# Altium schematic sheet PA-VHF_60W.SchDoc
size A4; SheetNumber: 3; SheetTotal: 5
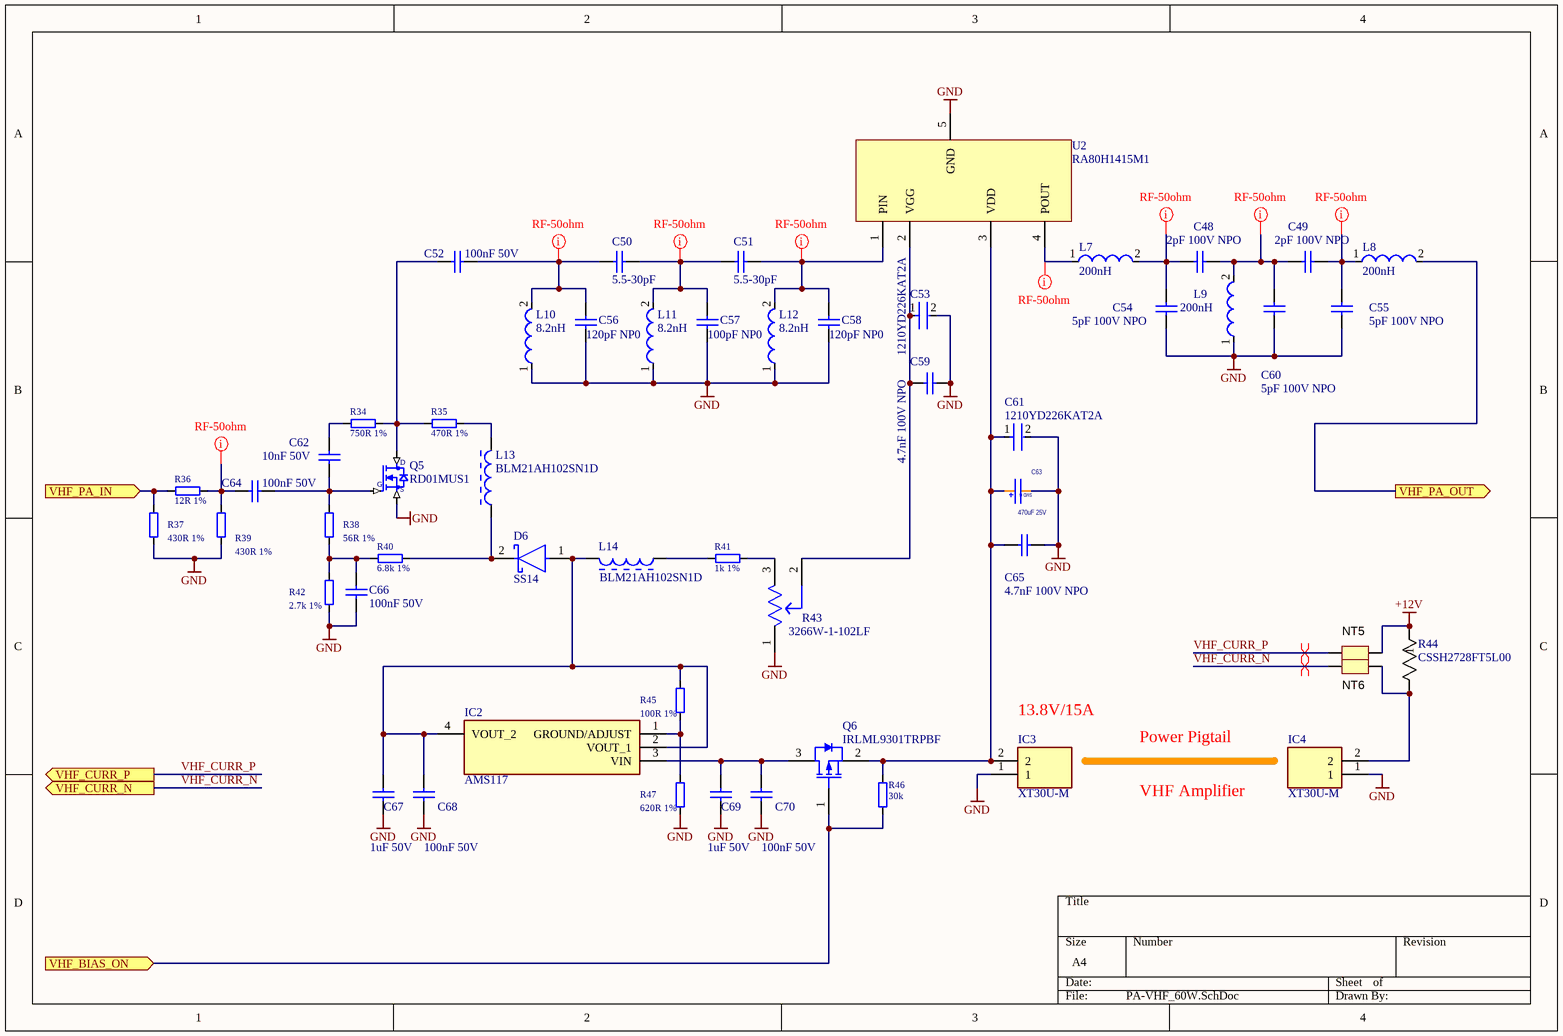
[diagram p0: PA-VHF_60W.SchDoc]

## Parts
C48  2pF 100V NPO  [C-1206]
C49  2pF 100V NPO  [C-1206]
C50  5.5-30pF  [CAP-ADJ-SMD_L4.5-W3.2-L]
C51  5.5-30pF  [CAP-ADJ-SMD_L4.5-W3.2-L]
C52  100nF 50V  [C-0805]
C53  1210YD226KAT2A  [FP-1210-L_3_3_0_4-W_2_5_0-MFG]
C54  5pF 100V NPO  [C-1206]
C55  5pF 100V NPO  [C-1206]
C56  120pF NP0  [C-0805]
C57  100pF NP0  [C-0805]
C58  120pF NP0  [C-0805]
C59  4.7nF 100V NPO  [C-1206]
C60  5pF 100V NPO  [C-1206]
C61  1210YD226KAT2A  [FP-1210-L_3_3_0_4-W_2_5_0-MFG]
C62  10nF 50V  [C-0805]
C63  470uF 25V  [SMD-G-10X10.2]
C64  100nF 50V  [C-0805]
C65  4.7nF 100V NPO  [C-1206]
C66  100nF 50V  [C-0805]
C67  1uF 50V  [C-0805]
C68  100nF 50V  [C-0805]
C69  1uF 50V  [C-0805]
C70  100nF 50V  [C-0805]
D6  SS14  [FP-403AE-MFG]
IC2  AMS117  [SOT229P700X180-4N]
IC3  XT30U-M  [XT30UM]
IC4  XT30U-M  [XT30UM]
L7  200nH  [AirCoil_200nH]
L8  200nH  [AirCoil_200nH]
L9  200nH  [AirCoil_200nH]
L10  8.2nH  [L-0805]
L11  8.2nH  [L-0805]
L12  8.2nH  [L-0805]
L13  BLM21AH102SN1D  [INDC2013X105X50LL20T20]
L14  BLM21AH102SN1D  [INDC2013X105X50LL20T20]
NT5  Net-Tie  [Net-Tie_10mil]  (value not drawn)  (net tie, no BOM)
NT6  Net-Tie  [Net-Tie_10mil]  (value not drawn)  (net tie, no BOM)
Q5  RD01MUS1  [RD01MUS2_MTS]
Q6  IRLML9301TRPBF  [INF-SOT-23-3_V]
R34  750R 1%  [R-0805]
R35  470R 1%  [R-0805]
R36  12R 1%  [R-0805]
R37  430R 1%  [R-0805]
R38  56R 1%  [R-0805]
R39  430R 1%  [R-0805]
R40  6.8k 1%  [R-0805]
R41  1k 1%  [R-0805]
R42  2.7k 1%  [R-0805]
R43  3266W-1-102LF  [FP-3266W-MFG]
R44  CSSH2728FT5L00  [STA_CSSH2728_STP]
R45  100R 1%  [R-0805]
R46  30k  [R-0603]
R47  620R 1%  [R-0805]
U2  RA80H1415M1  [RA80H1415M1]

## Ports
VHF_BIAS_ON (in), VHF_CURR_N (out), VHF_CURR_P (out), VHF_PA_IN (in), VHF_PA_OUT (out)

## Nets
+12V: NT5.2 R44.1
GND: C53.2 C54.1 C55.1 C56.2 C57.2 C58.2 C59.2 C60.1 C61.2 C63.2 C65.2 C66.1 C67.1 C68.1 C69.1 C70.1 IC3.1 IC4.1 L9.1 L10.1 L11.1 L12.1 Q5.1(S) R37.1 R39.1 R42.1 R43.1(CCW) R47.1 U2.5(GND)
VHF_BIAS_ON: Q6.1(GATE) R46.2 ; port VHF_BIAS_ON
VHF_CURR_N: NT6.1 ; port VHF_CURR_N
VHF_CURR_P: NT5.1 ; port VHF_CURR_P
VHF_PA_IN: R36.1 R37.2 ; port VHF_PA_IN
VHF_PA_OUT: L8.2 ; port VHF_PA_OUT
NetC48_1: C48.1 C54.2 L7.2
NetC48_2: C48.2 C49.1 C60.2 L9.2
NetC49_2: C49.2 C55.2 L8.1
NetC50_1: C50.1 C52.2 C56.1 L10.2
NetC50_2: C50.2 C51.1 C57.1 L11.2
NetC51_2: C51.2 C58.1 L12.2 U2.1(PIN)
NetC52_1: C52.1 Q5.3(D) R34.1 R35.2
NetC53_1: C53.1 C59.1 R43.2(WIPER) U2.2(VGG)
NetC61_1: C61.1 C63.1 C65.1 IC3.2 Q6.2(SOURCE) R46.1 U2.3(VDD)
NetC62_1: C62.1 C64.2 Q5.2 R38.2
NetC62_2: C62.2 R34.2
NetC64_1: C64.1 R36.2 R39.2
NetC66_2: C66.2 R38.1 R40.2 R42.2
NetC67_2: C67.2 C68.2 D6.1(A) IC2.2(VOUT_1) IC2.4(VOUT_2) L14.2 R45.2
NetC69_2: C69.2 C70.2 IC2.3(VIN) Q6.3(DRAIN)
NetD6_2: D6.2(C) L13.1 R40.1
NetIC2_1: IC2.1(GROUND/ADJUST) R45.1 R47.2
NetIC4_2: IC4.2 NT6.2 R44.2
NetL7_1: L7.1 U2.4(POUT)
NetL13_2: L13.2 R35.1
NetL14_1: L14.1 R41.2
NetR41_1: R41.1 R43.3(CW)

## Layout directives
rule Width Constraint [Pref Impedance = 50,00ohms    Min Impedance = 50,00ohms    Max Impedance = 50,00ohms]: NetC48_1, NetC48_2, NetC49_2, NetC50_1, NetC50_2, NetC51_2, NetC64_1, NetL7_1
differential pair: VHF_CURR_N, VHF_CURR_P

## Notes on the sheet
- (near IC3) 13.8V/15A
- Power Pigtail
- VHF Amplifier
- (in symbol RD01MUS1) G
- (in symbol SMD-G 470uF 25V) SMD G

## Library data of the parts
C48 C49 C52 C54 C55 C59 C60 C62 C64-C70 = C semi: Ceramic Multilayer Capacitor
C50 C51 C56-C58 = C semi: Ceramic Multilayer Capacitor; Manufacturer: Yageo/Phycomp; Manufacturer P/N: CC0603JRNPO9BN102; numsch: 011; TypeNum: 155; Parameters: 1nF, NP0, 50V, ±5%; Tolerance: ±10%; Voltage: *
C53 C61 = CMP-2000-05483-2: General Purpose Ceramic Capacitor, 1210, 22uF, 10%, X5R, 15%, 16V; Tolerance: 10%; Width: 0.098inch; Length: 3.2mm; Min Operating Temperature: -55°C; Capacitance: 22uF; Case/Package: 1210; Termination: SMD/SMT; Voltage: 16V; Number of Pins: 2; Thickness: 0.11inch; Height: 2.79mm; Weight: 0.000564oz; Case Code (Imperial): 1210; Contact Plating: Tin; Lead Free: Lead Free; RoHS Compliant: Yes; Packaging: Tape and Reel; Package Quantity: 1; Construction: Flat; Series: -; REACH SVHC: No SVHC; Case Code (Metric): 3225; Size: 2.79mm; Radiation Hardening: No; Voltage Rating: 16V; Depth: 2.5mm; Mount: Surface Mount; Voltage Rating (DC): 16V; Dielectric: X5R; Max Operating Temperature: 85°C
C63 = SMD-G 470uF 25V: CAP ALUM 470UF 20% 25V SMD; Manufacturer: KEMET; Manufacturer PartNumber: EDH477M025A9PAA; Value: 470µF; Pricing Аlternative: 0.05; Temp.Characteristic: –55 °C to +105 °C; Note: Aluminum Electrolytic Capacitors; Detailed Description: 470µF 25V Aluminum Electrolytic Capacitors Radial, Can - SMD  2000 Hrs @ 105°C; Lifetime @ Temp: 2000Hrs@105℃; ComponentLink2URL: http://www.mouser.com/ds/2/315/ABA0000C1181-947564.pdf; Dealer Digi-Key: https://www.digikey.com/product-detail/en/kemet/EDH477M025A9PAA/EDH477M025A9PAA-ND/6597660; Dealer Аlternative: https://detail.1688.com/offer/541866342432.html; Package / Case: G, 0.394" Dia (10.00mm); Pricing Digi-Key: 0.21; Publisher: Catcatcat Electronics; Tolerance: ±20 %; Voltage: 25V; HelpURL: https://api.kemet.com/component-edge/download/datasheet/EDH477M025A9PAA.pdf; website developer: http://catcatcat.d-lan.dp.ua/; PartNumber Digi-Key: EDH477M025A9PAA; Assembly type: Manual Part
D6 = CMP-2000-04943-2: DIODE SCHOTTKY 40V 1A SMA; Manufacturer: ON Semiconductor; Peak Reverse Current: 0.2mA; Max Junction Temp: +125°C; Standoff Height: 0.05mm; Max Surge Forward Current: 40A; Mouser Description: Schottky Diodes & Rectifiers SMA 40V 1.0A; RoHS: TRUE; Lead Free: Yes; Manufacturer Part Number: SS14; Device Class L3: Schottky Diodes; Category: Diode; Automotive: No; Digikey Description: DIODE SCHOTTKY 40V 1A SMA; ComponentLink2Description: Datasheet; Device Class L2: Diodes; Height: 2.5mm; Temperature Range High: +125°C; ComponentLink2URL: https://www.onsemi.com/pub/Collateral/SS19-D.PDF; Device Class L1: Discrete Semiconductors; Package: 403AE; Octopart: https://octopart.com/ss14-on+semiconductor-29205033; Max Repetitive Reverse Voltage: 40V; Temperature Range Low: -65°C; Forward Current: 1A; Temperature: -65°C to +125°C
IC2 = AMS117: Integrated Circuit; Manufacturer_Name: Advanced Monolithic Systems; Datasheet Link: http://www.advanced-monolithic.com/pdf/ds1117.pdf; Height: 1.8mm; Manufacturer_Part_Number: AMS117
IC3 IC4 = XT30U-M: Integrated Circuit; Manufacturer_Name: Amass; Datasheet Link: https://www.tme.eu/Document/3cbfa5cfa544d79584972dd5234a409e/XT30U%20SPEC.pdf; Height: 10.7mm; Manufacturer_Part_Number: XT30U-M
L7-L12 = RF_inductor
L13 L14 = CMP-2000-05954-1: Chip Bead, 1000 Ohm, +/- 25%, 200 mA, -55 to 85 degC, 2-Pin SMD, RoHS, Tape and Reel; Manufacturer: Murata; Brand: MurataElectronics; Test Frequency: 100MHz; Maximum DC Resistance: 450mOhms; Case Length: 2mm; Maximum DC Current: 200mA; Case Height: 0.85mm; Case Width: 1.25mm; Impedance: 1kOhms; Datasheet URL: http://datasheet.octopart.com/BLM21AH102SN1D-Murata-datasheet-629859.pdf; Datasheet Version: 11/2017; Dimensions: 1.25mmWx2mmLx0.85mmH; Manufacturer URL: http://www.murata.com/; Packaging: Reel; Product: FerriteChipBeads; Product Category: EMIFilterBeads,Chips&Arrays; Operating Temperature Range: -55Cto+125C; Package / Case: 0805(2012metric); Series: BLM21A; Mounting Technology: SurfaceMount; Termination Style: SMD/SMT; Tolerance: 25%; RoHS: Details; Package Reference: 0805; Factory Pack Quantity: 4000; Package Description: 2-Pin Surface Mount Device, Body 2 x1.25 mm
NT5 NT6 = Net-Tie: Single point connection between nets.; SymbolCreator: codlsc; SymbolVersion: 2009-07-01; MountType: SMT; PackageReference: N/A; Publisher: Texas Instruments; LatestRevisionDate: 2014-12-30; LatestRevisionNote: Added Alternate PartNumber and Alternate Manufacturer parameters to appropriate components.
Q6 = CMP-2000-06487-1: HEXFET(R) Power MOSFET, 3.6 A, 30 V, -55 to 150 degC, 3-Pin SOT-23, RoHS, Tape and Reel; Manufacturer: InfineonTechnologies; Drain to Source Voltage (Vdss): 30V; Gate Charge (Qg) @ Vgs: 4.8nC@4.5V; Rds On (Max) @ Id, Vgs: 64mOhm@3.6A,10V; FET Type: MOSFETP-Channel,MetalOxide; Current - Continuous Drain (Id) @ 25°C: 3.6A(Ta); Power - Max: 1.3W; Vgs(th) (Max) @ Id: 2.4V@10µA; FET Feature: Standard; Input Capacitance (Ciss) @ Vds: 388pF@25V; Operating Temperature: -55°C~150°C(TJ); Series: HEXFET®; Family: Transistors-FETs,MOSFETs-Single; Manufacturer URL: http://www.infineon.com/; Package Reference: SOT-23-3; Datasheet Version: 02/2012; Category: DiscreteSemiconductorProducts; Part Status: Active; Mounting Technology: SurfaceMount; Datasheet URL: http://www.infineon.com/dgdl/irlml9301pbf.pdf?fileId=5546d462533600a401535668e5e42640; Supplier Device Package: Micro3™/SOT-23; Mounting Type: SurfaceMount; Packaging: Tape&Reel(TR); Package / Case: TO-236-3,SC-59,SOT-23-3; Package Description: 3-Pin Small Outline Transistor, Body 2.92 x 1.3 mm, Pitch 0.95 mm
R34-R42 R45 R47 = RES semi: Chip Resistor; Power: *; TCR: *; Series: *; Tolerance: *
R43 = CMP-07234-000016-1: TRIMMER 1K OHM 0.25W PC PIN TOP; Manufacturer: Bourns; Manufacturer Part Number: 3266W-1-103LF; Temperature Coefficient: 100ppm/°C; Tolerance: 10%; Value: 10kΩ; Standoff Height: 0.43mm; Device Class L3: Variable Resistors and Potentiometers; ComponentLink2URL: https://www.bourns.com/docs/Product-Datasheets/3266.pdf; ComponentLink2Description: Datasheet; Device Class L2: Resistors; Power Rating: 0.25W; Mouser Description: Trimmer Resistors - Through Hole 1/4 10Kohms 10% SQ W/Standoff Sealed; Category: Res; Digikey Description: TRIMMER 10K OHM 0.25W PC PIN TOP; Device Class L1: Passive Components; Octopart: https://octopart.com/3266w-1-103lf-bourns-81445; Height: 9.02mm; Temperature Range High: +125°C; Series: 3266; Temperature Range Low: -55°C; Composition: Cermet; Resistance: 10kΩ; Lead Free: Yes; RoHS: TRUE; Automotive: No; Package: 3266W; Temperature: -55°C to +125°C
R44 = CSSH2728FT5L00: No Description Available; Mfr_Name: Stackpole International; Copyright: Copyright (C) 2022 Ultra Librarian. All rights reserved.; Manufacturer_Part_Number: CSSH2728FT5L00; RefDes: RefDes; Type: DEV
R46 = RES semi: Chip Resistor; Manufacturer: Yageo/Phycomp; Manufacturer P/N: RC0603FR-0749R9L; numsch: 021; TypeNum: 212; Parameters: 49.9R, RC, 0.1W, ±1%, TCR ±100ppm; Power: *; TCR: *; Series: *; Tolerance: *